# Altium schematic sheet Chov2_led.SchDoc
size A4; DocumentNumber: 3; SheetNumber: 3; SheetTotal: 3; LotOfPieces: 1
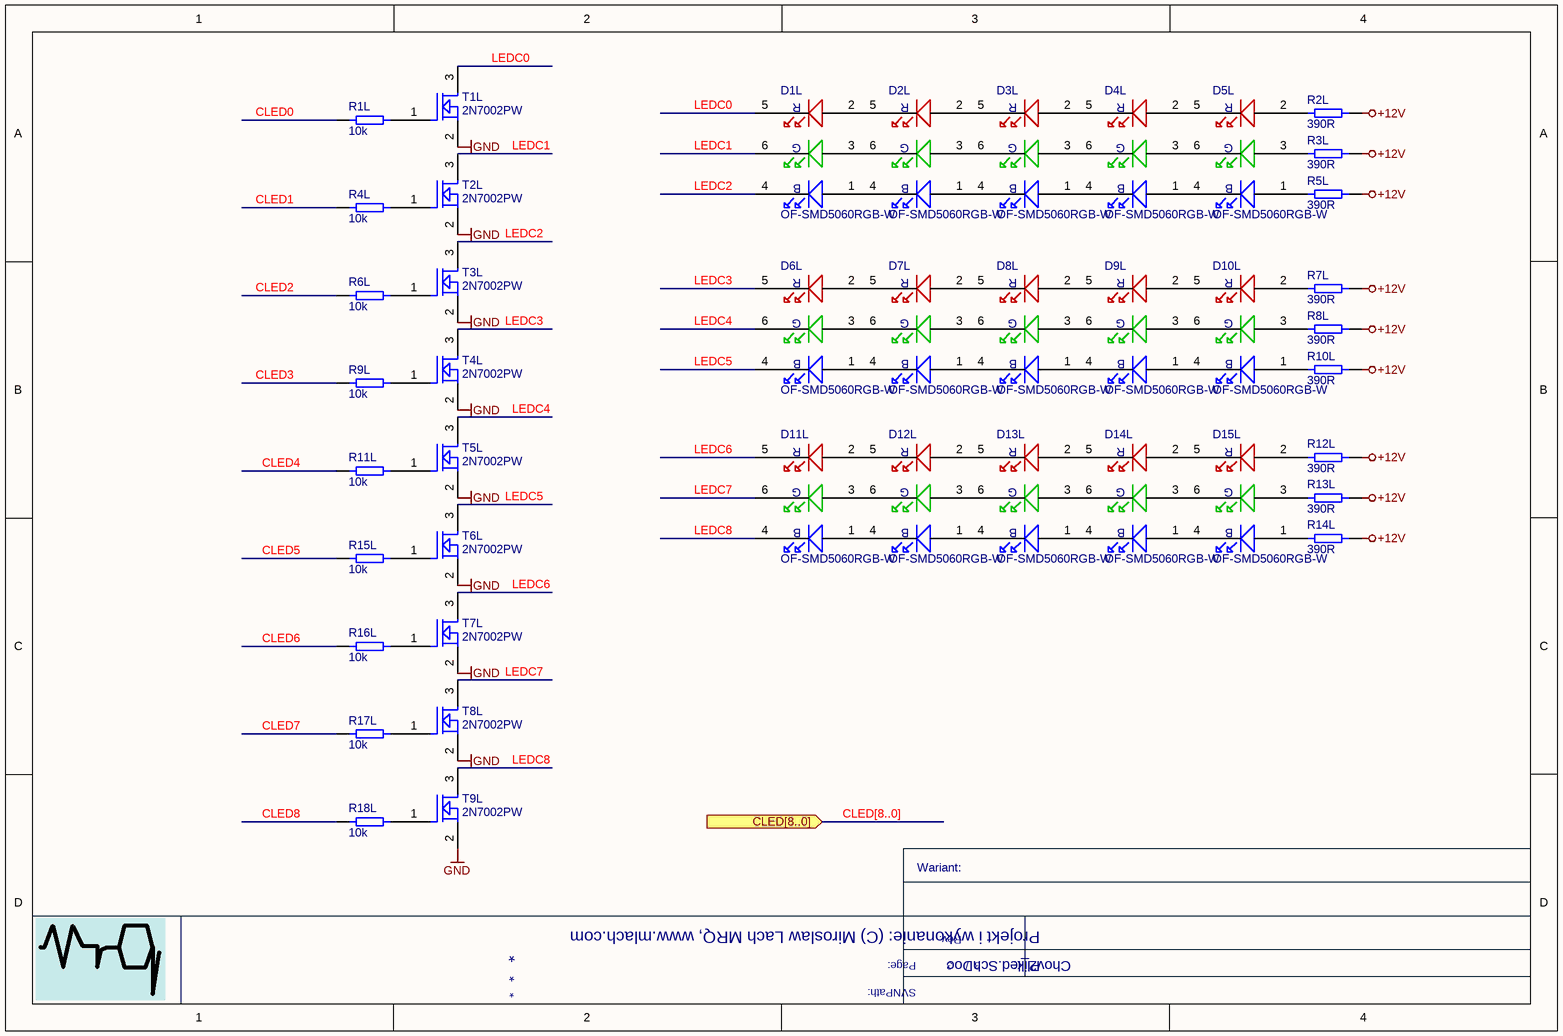
[diagram p0: Chov2_led.SchDoc]

## Parts
D1L  OF-SMD5060RGB-W  [OF-SMD5060RGB-W]
D2L  OF-SMD5060RGB-W  [OF-SMD5060RGB-W]
D3L  OF-SMD5060RGB-W  [OF-SMD5060RGB-W]
D4L  OF-SMD5060RGB-W  [OF-SMD5060RGB-W]
D5L  OF-SMD5060RGB-W  [OF-SMD5060RGB-W]
D6L  OF-SMD5060RGB-W  [OF-SMD5060RGB-W]
D7L  OF-SMD5060RGB-W  [OF-SMD5060RGB-W]
D8L  OF-SMD5060RGB-W  [OF-SMD5060RGB-W]
D9L  OF-SMD5060RGB-W  [OF-SMD5060RGB-W]
D10L  OF-SMD5060RGB-W  [OF-SMD5060RGB-W]
D11L  OF-SMD5060RGB-W  [OF-SMD5060RGB-W]
D12L  OF-SMD5060RGB-W  [OF-SMD5060RGB-W]
D13L  OF-SMD5060RGB-W  [OF-SMD5060RGB-W]
D14L  OF-SMD5060RGB-W  [OF-SMD5060RGB-W]
D15L  OF-SMD5060RGB-W  [OF-SMD5060RGB-W]
R1L  OtherParams: 10k  [0603-IPC]  (hidden comment: 0603WGF10KT5E)
R2L  OtherParams: 390R  [0805]  (hidden comment: 0805WAF 390R T5E)
R3L  OtherParams: 390R  [0805]  (hidden comment: 0805WAF 390R T5E)
R4L  OtherParams: 10k  [0603-IPC]  (hidden comment: 0603WGF10KT5E)
R5L  OtherParams: 390R  [0805]  (hidden comment: 0805WAF 390R T5E)
R6L  OtherParams: 10k  [0603-IPC]  (hidden comment: 0603WGF10KT5E)
R7L  OtherParams: 390R  [0805]  (hidden comment: 0805WAF 390R T5E)
R8L  OtherParams: 390R  [0805]  (hidden comment: 0805WAF 390R T5E)
R9L  OtherParams: 10k  [0603-IPC]  (hidden comment: 0603WGF10KT5E)
R10L  OtherParams: 390R  [0805]  (hidden comment: 0805WAF 390R T5E)
R11L  OtherParams: 10k  [0603-IPC]  (hidden comment: 0603WGF10KT5E)
R12L  OtherParams: 390R  [0805]  (hidden comment: 0805WAF 390R T5E)
R13L  OtherParams: 390R  [0805]  (hidden comment: 0805WAF 390R T5E)
R14L  OtherParams: 390R  [0805]  (hidden comment: 0805WAF 390R T5E)
R15L  OtherParams: 10k  [0603-IPC]  (hidden comment: 0603WGF10KT5E)
R16L  OtherParams: 10k  [0603-IPC]  (hidden comment: 0603WGF10KT5E)
R17L  OtherParams: 10k  [0603-IPC]  (hidden comment: 0603WGF10KT5E)
R18L  OtherParams: 10k  [0603-IPC]  (hidden comment: 0603WGF10KT5E)
T1L  2N7002PW  [SOT323-3_FLOW]
T2L  2N7002PW  [SOT323-3_FLOW]
T3L  2N7002PW  [SOT323-3_FLOW]
T4L  2N7002PW  [SOT323-3_FLOW]
T5L  2N7002PW  [SOT323-3_FLOW]
T6L  2N7002PW  [SOT323-3_FLOW]
T7L  2N7002PW  [SOT323-3_FLOW]
T8L  2N7002PW  [SOT323-3_FLOW]
T9L  2N7002PW  [SOT323-3_FLOW]

## Ports
CLED[8..0]

## Nets
+12V: R2L.2 R3L.2 R5L.2 R7L.2 R8L.2 R10L.2 R12L.2 R13L.2 R14L.2
GND: T1L.2(SOURCE) T2L.2(SOURCE) T3L.2(SOURCE) T4L.2(SOURCE) T5L.2(SOURCE) T6L.2(SOURCE) T7L.2(SOURCE) T8L.2(SOURCE) T9L.2(SOURCE)
CLED0: R1L.1
CLED1: R4L.1
CLED2: R6L.1
CLED3: R9L.1
CLED4: R11L.1
CLED5: R15L.1
CLED6: R16L.1
CLED7: R17L.1
CLED8: R18L.1
LEDC0: D1L.5(CATH) T1L.3(DRAIN)
LEDC1: D1L.6(CATH) T2L.3(DRAIN)
LEDC2: D1L.4(CATH) T3L.3(DRAIN)
LEDC3: D6L.5(CATH) T4L.3(DRAIN)
LEDC4: D6L.6(CATH) T5L.3(DRAIN)
LEDC5: D6L.4(CATH) T6L.3(DRAIN)
LEDC6: D11L.5(CATH) T7L.3(DRAIN)
LEDC7: D11L.6(CATH) T8L.3(DRAIN)
LEDC8: D11L.4(CATH) T9L.3(DRAIN)
NetD1L_1: D1L.1(ANOD) D2L.4(CATH)
NetD1L_2: D1L.2(ANOD) D2L.5(CATH)
NetD1L_3: D1L.3(ANOD) D2L.6(CATH)
NetD2L_1: D2L.1(ANOD) D3L.4(CATH)
NetD2L_2: D2L.2(ANOD) D3L.5(CATH)
NetD2L_3: D2L.3(ANOD) D3L.6(CATH)
NetD3L_1: D3L.1(ANOD) D4L.4(CATH)
NetD3L_2: D3L.2(ANOD) D4L.5(CATH)
NetD3L_3: D3L.3(ANOD) D4L.6(CATH)
NetD4L_1: D4L.1(ANOD) D5L.4(CATH)
NetD4L_2: D4L.2(ANOD) D5L.5(CATH)
NetD4L_3: D4L.3(ANOD) D5L.6(CATH)
NetD5L_1: D5L.1(ANOD) R5L.1
NetD5L_2: D5L.2(ANOD) R2L.1
NetD5L_3: D5L.3(ANOD) R3L.1
NetD6L_1: D6L.1(ANOD) D7L.4(CATH)
NetD6L_2: D6L.2(ANOD) D7L.5(CATH)
NetD6L_3: D6L.3(ANOD) D7L.6(CATH)
NetD7L_1: D7L.1(ANOD) D8L.4(CATH)
NetD7L_2: D7L.2(ANOD) D8L.5(CATH)
NetD7L_3: D7L.3(ANOD) D8L.6(CATH)
NetD8L_1: D8L.1(ANOD) D9L.4(CATH)
NetD8L_2: D8L.2(ANOD) D9L.5(CATH)
NetD8L_3: D8L.3(ANOD) D9L.6(CATH)
NetD9L_1: D9L.1(ANOD) D10L.4(CATH)
NetD9L_2: D9L.2(ANOD) D10L.5(CATH)
NetD9L_3: D9L.3(ANOD) D10L.6(CATH)
NetD10L_1: D10L.1(ANOD) R10L.1
NetD10L_2: D10L.2(ANOD) R7L.1
NetD10L_3: D10L.3(ANOD) R8L.1
NetD11L_1: D11L.1(ANOD) D12L.4(CATH)
NetD11L_2: D11L.2(ANOD) D12L.5(CATH)
NetD11L_3: D11L.3(ANOD) D12L.6(CATH)
NetD12L_1: D12L.1(ANOD) D13L.4(CATH)
NetD12L_2: D12L.2(ANOD) D13L.5(CATH)
NetD12L_3: D12L.3(ANOD) D13L.6(CATH)
NetD13L_1: D13L.1(ANOD) D14L.4(CATH)
NetD13L_2: D13L.2(ANOD) D14L.5(CATH)
NetD13L_3: D13L.3(ANOD) D14L.6(CATH)
NetD14L_1: D14L.1(ANOD) D15L.4(CATH)
NetD14L_2: D14L.2(ANOD) D15L.5(CATH)
NetD14L_3: D14L.3(ANOD) D15L.6(CATH)
NetD15L_1: D15L.1(ANOD) R14L.1
NetD15L_2: D15L.2(ANOD) R12L.1
NetD15L_3: D15L.3(ANOD) R13L.1
NetR1L_2: R1L.2 T1L.1(GATE)
NetR4L_2: R4L.2 T2L.1(GATE)
NetR6L_2: R6L.2 T3L.1(GATE)
NetR9L_2: R9L.2 T4L.1(GATE)
NetR11L_2: R11L.2 T5L.1(GATE)
NetR15L_2: R15L.2 T6L.1(GATE)
NetR16L_2: R16L.2 T7L.1(GATE)
NetR17L_2: R17L.2 T8L.1(GATE)
NetR18L_2: R18L.2 T9L.1(GATE)

## Buses and harness runs
bus CLED[8..0] = port CLED[8..0]

## Notes on the sheet
- Wariant:
- Projekt i wykonanie: (C) Miroslaw Lach MRQ, www.mlach.com
- SVNPath:
- Page:
- Rev.
- /
- Plik:
- (in symbol OF-SMD5060RGB-W[[/\]]5060) R; G; B

## Library data of the parts
D1L D2L D3L D4L D5L D6L D7L D8L D9L D10L D11L D12L D13L D14L D15L = OF-SMD5060RGB-W[[/\]]5060: Descript: 5050 Single Chip RGB Color Top LED; Currency5: PLN; Value: OF-SMD5060RGB-W; Dimensions: 5060; Supplier5: tme.pl; Reference5: OF-SMD5060RGB-W; Manufacturer5: Optoflash; Typ5: OF-SMD5060RGB-W; Price5: 1,3206; DateOfPrice5: 2014-01-04
R1L R4L R6L R9L R11L R15L R16L R17L R18L = 0603WGF10KT5E[[/\]]0603[[/\]]0.1W[[/\]]1%[[/\]]10k: DissPower: 0.1W; Tolerance: 1%; Descript: Resistor 10kohm, 0603, 1%; Reference5: SMD0603-10K-1%; Currency5: PLN; Value: 0603WGF10KT5E; Dimensions: 0603; Supplier5: tme.pl; Manufacturer5: Royal Ohm; Typ5: 0603WGF 10K T5E; Price5: 0,02755; DateOfPrice5: 2016-06-02
R2L R3L R5L R7L R8L R10L R12L R13L R14L = 0805WAF 390R T5E[[/\]]0805[[/\]]0.125W[[/\]]1%[[/\]]390R: DissPower: 0.125W; Tolerance: 1%; Descript: Resistor 390ohm, 0805, 1%; Reference5: SMD0805-390R-1%; Currency5: PLN; Value: 0805WAF 390R T5E; Dimensions: 0805; Supplier5: tme.pl; Manufacturer5: Royal Ohm; Typ5: 0805WAF 390R T5E; Price5: 0,029; DateOfPrice5: 2013-06-18
T1L T2L T3L T4L T5L T6L T7L T8L T9L = 2N7002PW[[/\]]SOT323-3: Descript: N-channel enhacement-mode vertical DMOS FET; Reference5: 1829184; Currency5: PLN; Value: 2N7002PW; Dimensions: SOT323-3; Supplier5: farnell.com; Price5: 0,88; DateOfPrice5: 2016-04-09; Manufacturer5: NXP; Typ5: 2N7002PW